# EasyEDA schematic SCH_The-weather-gian_2026-05-14.json
TITLE: Sheet_1; REV: 1.0; Date: 2026-05-10; Sheet: 1/1; Company: Your Company
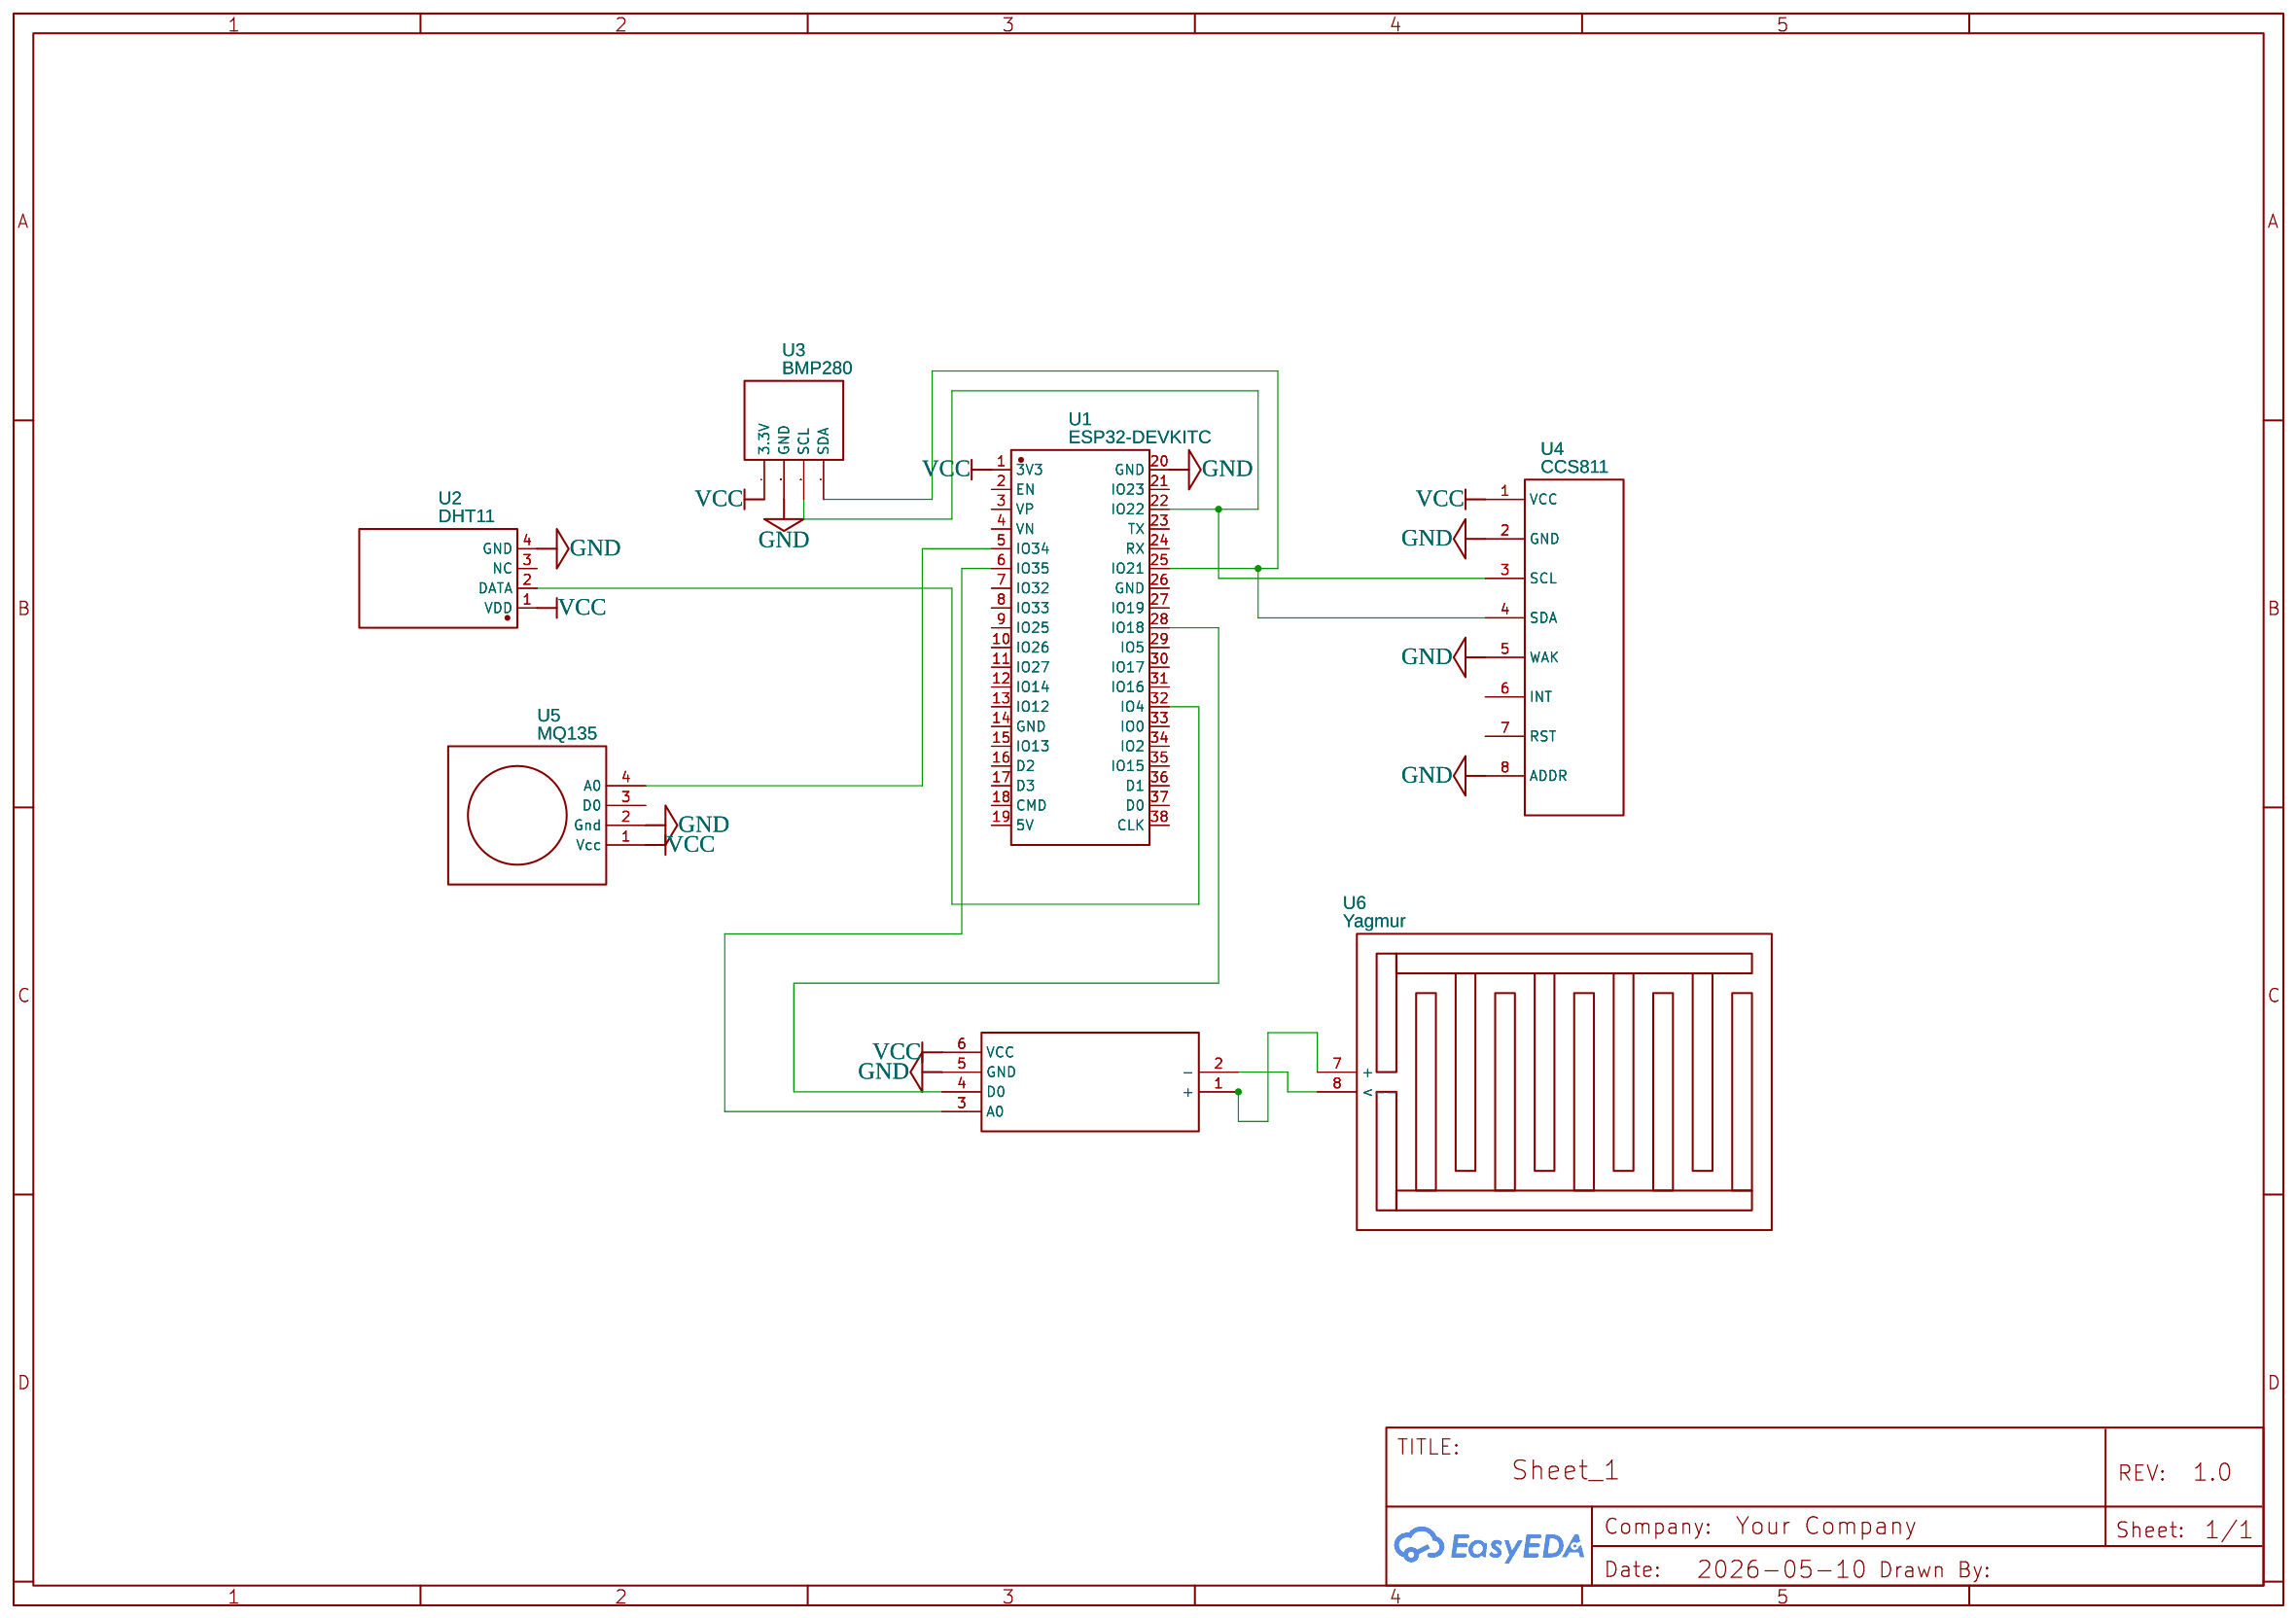
[diagram p0: schematic sheet]

## Parts
U1  ESP32-DEVKITC  [BULETM-SMD_ESP32-DEVKITC]
U2  DHT11  [SENSOR-TH_DHT11]
U3  BMP280  [BMP280YSF BMP280YSF BMP280YSF BMP]
U4  CCS811  [CCS811]
U5  MQ135  [MQ135]
U6  Yagmur  [RAIN SENSOR MODULE]

## Library data of the parts
U1 = ESP32-DEVKITC: Supplier: LCSC; Supplier Part: C571180; Manufacturer: ESPRESSIF(乐鑫); Manufacturer Part: ESP32-DevKitC; Contributor: lcsc
U2 = DHT11: Contributor: LCSC; Supplier: LCSC; Supplier Part: C117051; Manufacturer: 广州奥松; JLCPCB Part Class: Extended Part
U3 = BMP280: Contributor: jack080901
U4 = CCS811: Manufacturer Part: CO2_SENS; Contributor: alexsis_76
U5 = MQ135: Contributor: Creative_aditya rizki
U6 = Yagmur: Contributor: batuhan06

## Nets
GND: U1.20(GND) U2.4(GND) U3.6(GND) U4.2(GND) U4.5(WAK) U4.8(ADDR) U5.2(Gnd) U6.5(GND)
VCC: U1.1(3V3) U2.1(VDD) U3.7(3.3V) U4.1(VCC) U5.1(Vcc) U6.6(VCC)
Net-(U1-5): U1.5(IO34) U5.4(A0)
Net-(U1-6): U1.6(IO35) U6.3(A0)
Net-(U1-22): U1.22(IO22) U3.5(SCL) U4.3(SCL)
Net-(U1-25): U1.25(IO21) U3.4(SDA) U4.4(SDA)
Net-(U1-28): U1.28(IO18) U6.4(D0)
Net-(U1-32): U1.32(IO4) U2.2(DATA)
Net-(U6-1): U6.1(+) U6.7(+)
Net-(U6-2): U6.2(-) U6.8(<--)

Not connected (* = marked no-connect by the designer): U1 2(EN) 3(VP) 4(VN) 7(IO32) 8(IO33) 9(IO25) 10(IO26) 11(IO27) 12(IO14) 13(IO12) 14(GND) 15(IO13) 16(D2) 17(D3) 18(CMD) 19(5V) 21(IO23) 23(TX) 24(RX) 26(GND) 27(IO19) 29(IO5) 30(IO17) 31(IO16) 33(IO0) 34(IO2) 35(IO15) 36(D1) 37(D0) 38(CLK); U2 3(NC); U4 6(INT) 7(RST); U5 3(D0)
